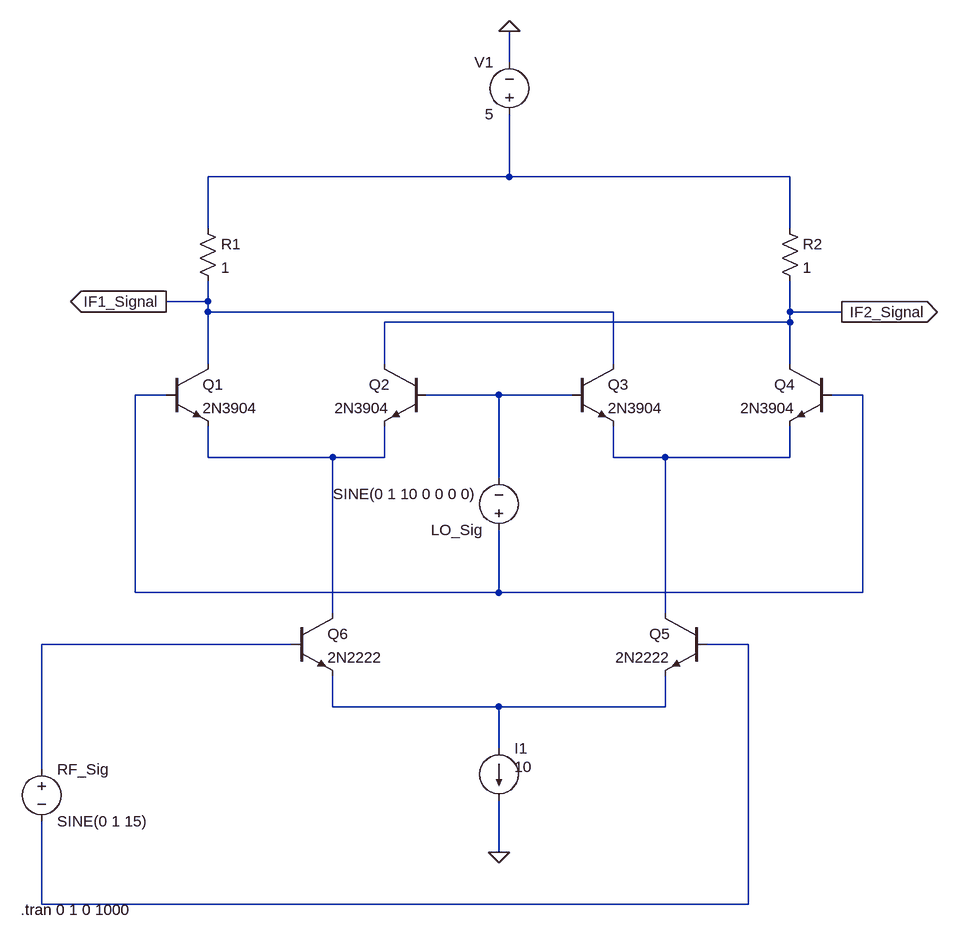
[diagram p0: schematic Double Balanced Gilbert Cell Mixer [FINALLY WORKING].asc]
Double Balanced Gilbert Cell Mixer [FINALLY WORKING].asc, the LTspice schematic file:
Version 4
SHEET 1 1432 808
WIRE 544 -512 544 -560
WIRE 544 -336 544 -432
WIRE 544 -336 80 -336
WIRE 976 -336 544 -336
WIRE 80 -256 80 -336
WIRE 976 -256 976 -336
WIRE 80 -144 80 -176
WIRE 80 -144 16 -144
WIRE 80 -128 80 -144
WIRE 704 -128 80 -128
WIRE 976 -128 976 -176
WIRE 1056 -128 976 -128
WIRE 976 -112 976 -128
WIRE 976 -112 352 -112
WIRE 80 -48 80 -128
WIRE 352 -48 352 -112
WIRE 704 -48 704 -128
WIRE 976 -48 976 -112
WIRE 16 0 -32 0
WIRE 528 0 416 0
WIRE 640 0 528 0
WIRE 1088 0 1040 0
WIRE 80 96 80 48
WIRE 272 96 80 96
WIRE 352 96 352 48
WIRE 352 96 272 96
WIRE 704 96 704 48
WIRE 784 96 704 96
WIRE 976 96 976 48
WIRE 976 96 784 96
WIRE 528 128 528 0
WIRE -32 304 -32 0
WIRE 528 304 528 208
WIRE 528 304 -32 304
WIRE 1088 304 1088 0
WIRE 1088 304 528 304
WIRE 272 336 272 96
WIRE 784 336 784 96
WIRE 208 384 -176 384
WIRE 912 384 848 384
WIRE 272 480 272 432
WIRE 528 480 272 480
WIRE 784 480 784 432
WIRE 784 480 528 480
WIRE 528 544 528 480
WIRE -176 576 -176 384
WIRE 528 704 528 624
WIRE -176 784 -176 656
WIRE 912 784 912 384
WIRE 912 784 -176 784
FLAG 528 704 0
FLAG 544 -560 0
FLAG 16 -144 IF1_Signal
IOPIN 16 -144 Out
FLAG 1056 -128 IF2_Signal
IOPIN 1056 -128 Out
SYMBOL npn 16 -48 R0
SYMATTR InstName Q1
SYMATTR Value 2N3904
SYMBOL npn 416 -48 M0
SYMATTR InstName Q2
SYMATTR Value 2N3904
SYMBOL npn 640 -48 R0
SYMATTR InstName Q3
SYMATTR Value 2N3904
SYMBOL npn 1040 -48 M0
SYMATTR InstName Q4
SYMATTR Value 2N3904
SYMBOL npn 848 336 M0
SYMATTR InstName Q5
SYMATTR Value 2N2222
SYMBOL npn 208 336 R0
SYMATTR InstName Q6
SYMATTR Value 2N2222
SYMBOL res 64 -272 R0
SYMATTR InstName R1
SYMATTR Value 1
SYMBOL res 960 -272 R0
SYMATTR InstName R2
SYMATTR Value 1
SYMBOL voltage 528 224 R180
WINDOW 3 35 72 Left 2
WINDOW 123 0 0 Left 0
WINDOW 39 0 0 Left 0
SYMATTR Value SINE(0 1 10 0 0 0 0)
SYMATTR InstName LO_Sig
SYMBOL voltage -176 560 R0
WINDOW 123 24 124 Left 2
WINDOW 39 0 0 Left 0
SYMATTR InstName RF_Sig
SYMATTR Value SINE(0 1 15)
SYMBOL voltage 544 -416 R180
WINDOW 0 24 96 Left 2
WINDOW 3 24 16 Left 2
WINDOW 123 0 0 Left 0
WINDOW 39 0 0 Left 0
SYMATTR InstName V1
SYMATTR Value 5
SYMBOL current 528 544 R0
WINDOW 123 0 0 Left 0
WINDOW 39 0 0 Left 0
WINDOW 3 24 28 Left 2
SYMATTR Value 10
SYMATTR InstName I1
TEXT -208 792 Left 2 !.tran 0 1 0 1000

The netlist it stands for:
* Double Balanced Gilbert Cell Mixer [FINALLY WORKING].asc
Q1 IF1_Signal N002 N004 0 2N3904
Q2 IF2_Signal N003 N004 0 2N3904
Q3 IF1_Signal N003 N005 0 2N3904
Q4 IF2_Signal N002 N005 0 2N3904
Q5 N005 N007 N008 0 2N2222
Q6 N004 N006 N008 0 2N2222
R1 N001 IF1_Signal 1
R2 N001 IF2_Signal 1
V§LO_Sig N002 N003 SINE(0 1 10 0 0 0 0)
V§RF_Sig N006 N007 SINE(0 1 15)
V1 N001 0 5
I1 N008 0 10
.model NPN NPN
.model PNP PNP
.lib standard.bjt
.tran 0 1 0 1000
.backanno
.end